# Altium schematic sheet MotorDrivers.SchDoc
size A4; SheetNumber: 3; SheetTotal: 6
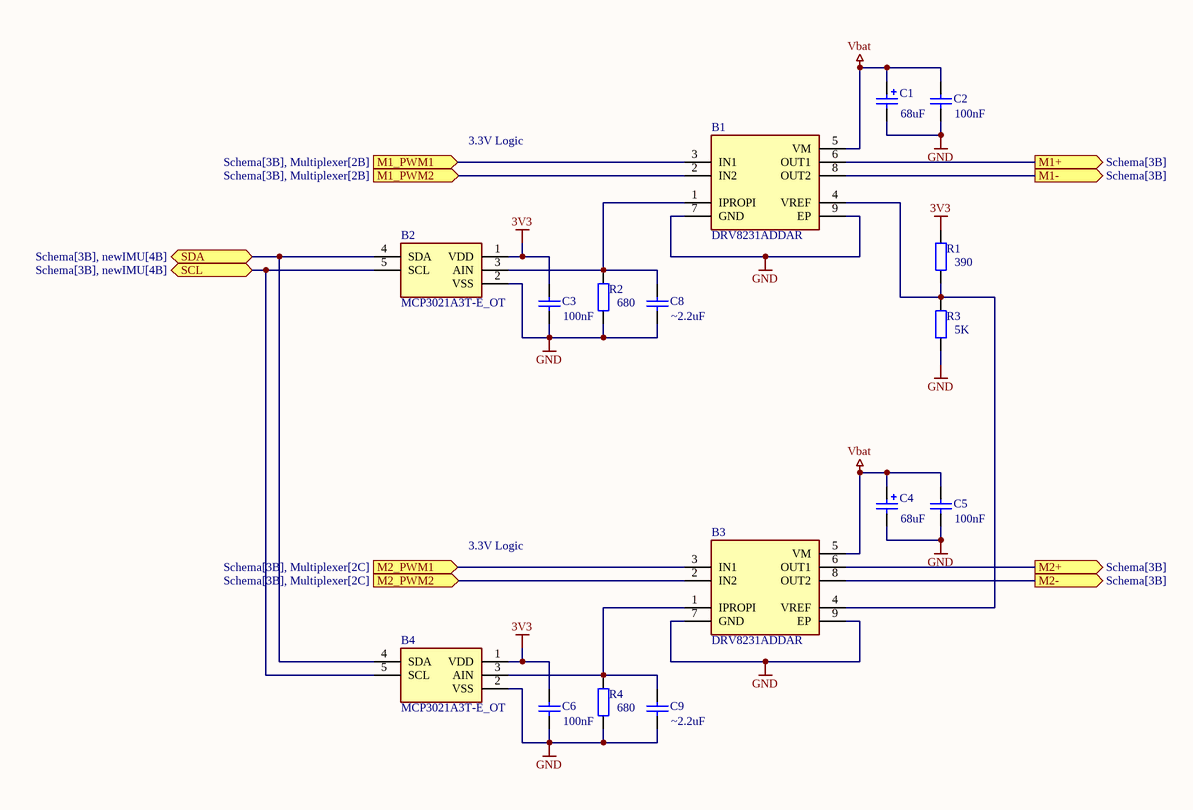
[diagram p0: MotorDrivers.SchDoc]

## Parts
B1  DRV8231ADDAR  [SOIC127P600X170-9M]
B2  MCP3021A3T-E_OT  [SOT95P280X145-5M]
B3  DRV8231ADDAR  [SOIC127P600X170-9M]
B4  MCP3021A3T-E_OT  [SOT95P280X145-5M]
C1  value 68uF  [CAP68uF]  (hidden comment: Cap Pol2)
C2  value 100nF  [0805_Lorin]  (hidden comment: Cap)
C3  value 100nF  [0805_Lorin]  (hidden comment: Cap)
C4  value 68uF  [CAP68uF]  (hidden comment: Cap Pol2)
C5  value 100nF  [0805_Lorin]  (hidden comment: Cap)
C6  value 100nF  [0805_Lorin]  (hidden comment: Cap)
C8  value ~2.2uF  [0805_Lorin]  (hidden comment: Cap)
C9  value ~2.2uF  [0805_Lorin]  (hidden comment: Cap)
R1  value 390  [0805_Lorin]  (hidden comment: Res2)
R2  value 680  [0805_Lorin]  (hidden comment: Res2)
R3  value 5K  [0805_Lorin]  (hidden comment: Res2)
R4  value 680  [0805_Lorin]  (hidden comment: Res2)

## Ports
M1+ (out, see Schema[3B]), M1- (out, see Schema[3B]), M1_PWM1 (in, see Schema[3B], Multiplexer[2B]), M1_PWM2 (in, see Schema[3B], Multiplexer[2B]), M2+ (out, see Schema[3B]), M2- (out, see Schema[3B]), M2_PWM1 (in, see Schema[3B], Multiplexer[2C]), M2_PWM2 (in, see Schema[3B], Multiplexer[2C]), SCL (bidir, see Schema[3B], newIMU[4B]), SDA (bidir, see Schema[3B], newIMU[4B])

## Nets
3V3: B2.1(VDD) B4.1(VDD) C3.2 C6.2 R1.2
GND: B1.7(GND) B1.9(EP) B2.2(VSS) B3.7(GND) B3.9(EP) B4.2(VSS) C1.2 C2.2 C3.1 C4.2 C5.2 C6.1 C8.1 C9.1 R2.1 R3.1 R4.1
Vbat: B1.5(VM) B3.5(VM) C1.1 C2.1 C4.1 C5.1
M1+: B1.6(OUT1) ; port M1+
M1-: B1.8(OUT2) ; port M1-
M1_PWM1: B1.3(IN1) ; port M1_PWM1
M1_PWM2: B1.2(IN2) ; port M1_PWM2
M2+: B3.6(OUT1) ; port M2+
M2-: B3.8(OUT2) ; port M2-
M2_PWM1: B3.3(IN1) ; port M2_PWM1
M2_PWM2: B3.2(IN2) ; port M2_PWM2
SCL: B2.5(SCL) B4.5(SCL) ; port SCL
SDA: B2.4(SDA) B4.4(SDA) ; port SDA
NetB1_1: B1.1(IPROPI) B2.3(AIN) C8.2 R2.2
NetB1_4: B1.4(VREF) B3.4(VREF) R1.1 R3.2
NetB3_1: B3.1(IPROPI) B4.3(AIN) C9.2 R4.2

## Notes on the sheet
- 3.3V Logic

## Library data of the parts
B1 B3 = DRV8231ADDAR: Motor Drives 33V H bridge motor driver with current regulation and current sense feedback; Manufacturer_Name: Texas Instruments; Geometry.Height: 1.7mm; Mouser Part Number: 595-DRV8231ADDAR; Mouser Price/Stock: https://www.mouser.co.uk/ProductDetail/Texas-Instruments/DRV8231ADDAR?qs=Li%252BoUPsLEnsv4Ur6m37LNQ%3D%3D; Manufacturer_Part_Number: DRV8231ADDAR; Datasheet Link: https://www.ti.com/lit/ds/symlink/drv8231a.pdf?ts=1647897918552&ref_url=https%253A%252F%252Fwww.ti.com%252Fstore%252Fti%252Fen%252Fp%252Fproduct%252F%253Fp%253DDRV8231ADDAR%2526keyMatch%253DDRV8231ADDAR%2526tisearch%253Dsearch-everything%2526usecase%253DO
B2 B4 = MCP3021A3T-E_OT: Analog to Digital Converters - ADC 10-bit ADC I2C Single Channel; Manufacturer_Name: Microchip; Manufacturer_Part_Number: MCP3021A3T-E/OT; Geometry.Height: 1.45mm; Mouser Part Number: 579-MCP3021A3T-E/OT; Mouser Price/Stock: https://www.mouser.co.uk/ProductDetail/Microchip-Technology/MCP3021A3T-E-OT?qs=uHi2%2FQoPa5Cra0xx31l%252Buw%3D%3D; Datasheet Link: http://www.microchip.com/mymicrochip/filehandler.aspx?ddocname=en011709
C1 C4 = Cap Pol2: Polarized Capacitor (Axial); Published: 8-Jun-2000; LatestRevisionDate: 17-Jul-2002; LatestRevisionNote: Re-released for DXP Platform.; PackageReference: POLAR0.8; Publisher: Altium Limited; PackageDescription: Polarized Capacitor; 2 Leads
C2 C3 C5 C6 C8 C9 = Cap: Capacitor; Published: 8-Jun-2000; LatestRevisionDate: 17-Jul-2002; LatestRevisionNote: Re-released for DXP Platform.; PackageReference: RAD-0.3; Publisher: Altium Limited; PackageDescription: Radial Cap, Thru-Hole; 2 Leads; 0.3 in Pin Spacing
R1-R4 = Res2: Resistor; Published: 8-Jun-2000; LatestRevisionDate: 17-Jul-2002; LatestRevisionNote: Re-released for DXP Platform.; PackageReference: AXIAL-0.4; Publisher: Altium Limited; PackageDescription: Axial Device, Thru-Hole; 2 Leads; 0.4 in Pin Spacing